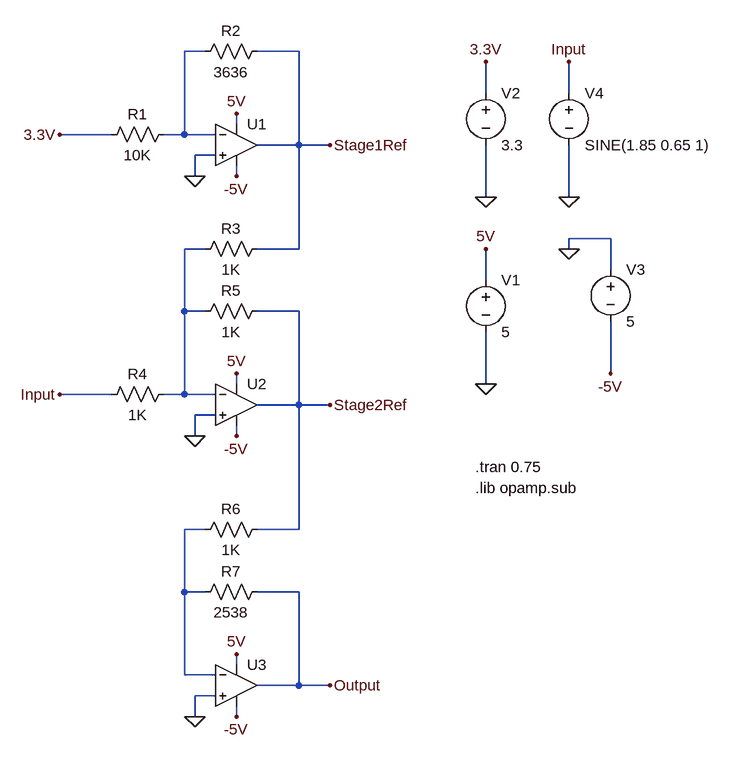
[diagram p0: schematic Amplifier Submodule.asc]
Amplifier Submodule.asc, the LTspice schematic file:
Version 4
SHEET 1 1184 1164
WIRE 256 64 224 64
WIRE 400 64 336 64
WIRE 688 128 688 80
WIRE 816 128 816 80
WIRE 304 176 304 160
WIRE 112 192 32 192
WIRE 224 192 224 64
WIRE 224 192 192 192
WIRE 272 192 224 192
WIRE 400 208 400 64
WIRE 400 208 336 208
WIRE 448 208 400 208
WIRE 272 224 240 224
WIRE 240 256 240 224
WIRE 304 256 304 240
WIRE 688 288 688 208
WIRE 816 288 816 208
WIRE 880 352 816 352
WIRE 256 368 224 368
WIRE 400 368 400 208
WIRE 400 368 336 368
WIRE 816 368 816 352
WIRE 880 400 880 352
WIRE 688 416 688 368
WIRE 224 464 224 368
WIRE 256 464 224 464
WIRE 400 464 336 464
WIRE 880 560 880 480
WIRE 304 576 304 560
WIRE 688 576 688 496
WIRE 112 592 32 592
WIRE 224 592 224 464
WIRE 224 592 192 592
WIRE 272 592 224 592
WIRE 400 608 400 464
WIRE 400 608 336 608
WIRE 448 608 400 608
WIRE 272 624 240 624
WIRE 240 656 240 624
WIRE 304 656 304 640
WIRE 256 800 224 800
WIRE 400 800 400 608
WIRE 400 800 336 800
WIRE 224 896 224 800
WIRE 256 896 224 896
WIRE 400 896 336 896
WIRE 304 1008 304 992
WIRE 224 1024 224 896
WIRE 272 1024 224 1024
WIRE 400 1040 400 896
WIRE 400 1040 336 1040
WIRE 448 1040 400 1040
WIRE 272 1056 240 1056
WIRE 240 1088 240 1056
WIRE 304 1088 304 1072
FLAG 688 576 0
FLAG 688 368 5V
FLAG 240 256 0
FLAG 688 288 0
FLAG 688 80 3.3V
FLAG 32 192 3.3V
FLAG 816 368 0
FLAG 880 560 -5V
FLAG 304 256 -5V
FLAG 304 160 5V
FLAG 448 208 Stage1Ref
FLAG 240 656 0
FLAG 304 656 -5V
FLAG 304 560 5V
FLAG 448 608 Stage2Ref
FLAG 816 288 0
FLAG 816 80 Input
FLAG 32 592 Input
FLAG 240 1088 0
FLAG 304 1088 -5V
FLAG 304 992 5V
FLAG 448 1040 Output
SYMBOL voltage 688 400 R0
SYMATTR InstName V1
SYMATTR Value 5
SYMBOL res 208 176 R90
WINDOW 0 0 56 VBottom 2
WINDOW 3 32 56 VTop 2
SYMATTR InstName R1
SYMATTR Value 10K
SYMBOL res 352 48 R90
WINDOW 0 0 56 VBottom 2
WINDOW 3 32 56 VTop 2
SYMATTR InstName R2
SYMATTR Value 3636
SYMBOL voltage 688 112 R0
SYMATTR InstName V2
SYMATTR Value 3.3
SYMBOL voltage 880 384 R0
SYMATTR InstName V3
SYMATTR Value 5
SYMBOL Opamps/UniversalOpamp2 304 208 R0
SYMATTR InstName U1
SYMBOL res 208 576 R90
WINDOW 0 0 56 VBottom 2
WINDOW 3 32 56 VTop 2
SYMATTR InstName R4
SYMATTR Value 1K
SYMBOL res 352 448 R90
WINDOW 0 0 56 VBottom 2
WINDOW 3 32 56 VTop 2
SYMATTR InstName R5
SYMATTR Value 1K
SYMBOL Opamps/UniversalOpamp2 304 608 R0
SYMATTR InstName U2
SYMBOL res 352 352 R90
WINDOW 0 0 56 VBottom 2
WINDOW 3 32 56 VTop 2
SYMATTR InstName R3
SYMATTR Value 1K
SYMBOL voltage 816 112 R0
SYMATTR InstName V4
SYMATTR Value SINE(1.85 0.65 1)
SYMBOL res 352 880 R90
WINDOW 0 0 56 VBottom 2
WINDOW 3 32 56 VTop 2
SYMATTR InstName R7
SYMATTR Value 2538
SYMBOL Opamps/UniversalOpamp2 304 1040 R0
SYMATTR InstName U3
SYMBOL res 352 784 R90
WINDOW 0 0 56 VBottom 2
WINDOW 3 32 56 VTop 2
SYMATTR InstName R6
SYMATTR Value 1K
TEXT 672 704 Left 2 !.tran 0.75
TEXT 672 736 Left 2 !.lib opamp.sub

The netlist it stands for:
* Amplifier Submodule.asc
V1 5V 0 5
R1 N001 3.3V 10K
R2 Stage1Ref N001 3636
V2 3.3V 0 3.3
V3 0 -5V 5
XU1 0 N001 5V -5V Stage1Ref level.2 Avol=1Meg GBW=10Meg Slew=10Meg ilimit=25m rail=0 Vos=0 phimargin=45 en=0 enk=0 in=0 ink=0 Rin=500Meg  ; pins IN+ IN- V+ V- OUT
R4 N002 Input 1K
R5 Stage2Ref N002 1K
XU2 0 N002 5V -5V Stage2Ref level.2 Avol=1Meg GBW=10Meg Slew=10Meg ilimit=25m rail=0 Vos=0 phimargin=45 en=0 enk=0 in=0 ink=0 Rin=500Meg  ; pins IN+ IN- V+ V- OUT
R3 Stage1Ref N002 1K
V4 Input 0 SINE(1.85 0.65 1)
R7 Output N003 2538
XU3 0 N003 5V -5V Output level.2 Avol=1Meg GBW=10Meg Slew=10Meg ilimit=25m rail=0 Vos=0 phimargin=45 en=0 enk=0 in=0 ink=0 Rin=500Meg  ; pins IN+ IN- V+ V- OUT
R6 Stage2Ref N003 1K
.tran 0.75
.lib opamp.sub
.lib UniversalOpamps2.sub
.backanno
.end